# EAGLE design Bidirectional_Amp_test (EAGLE 9.5.1)
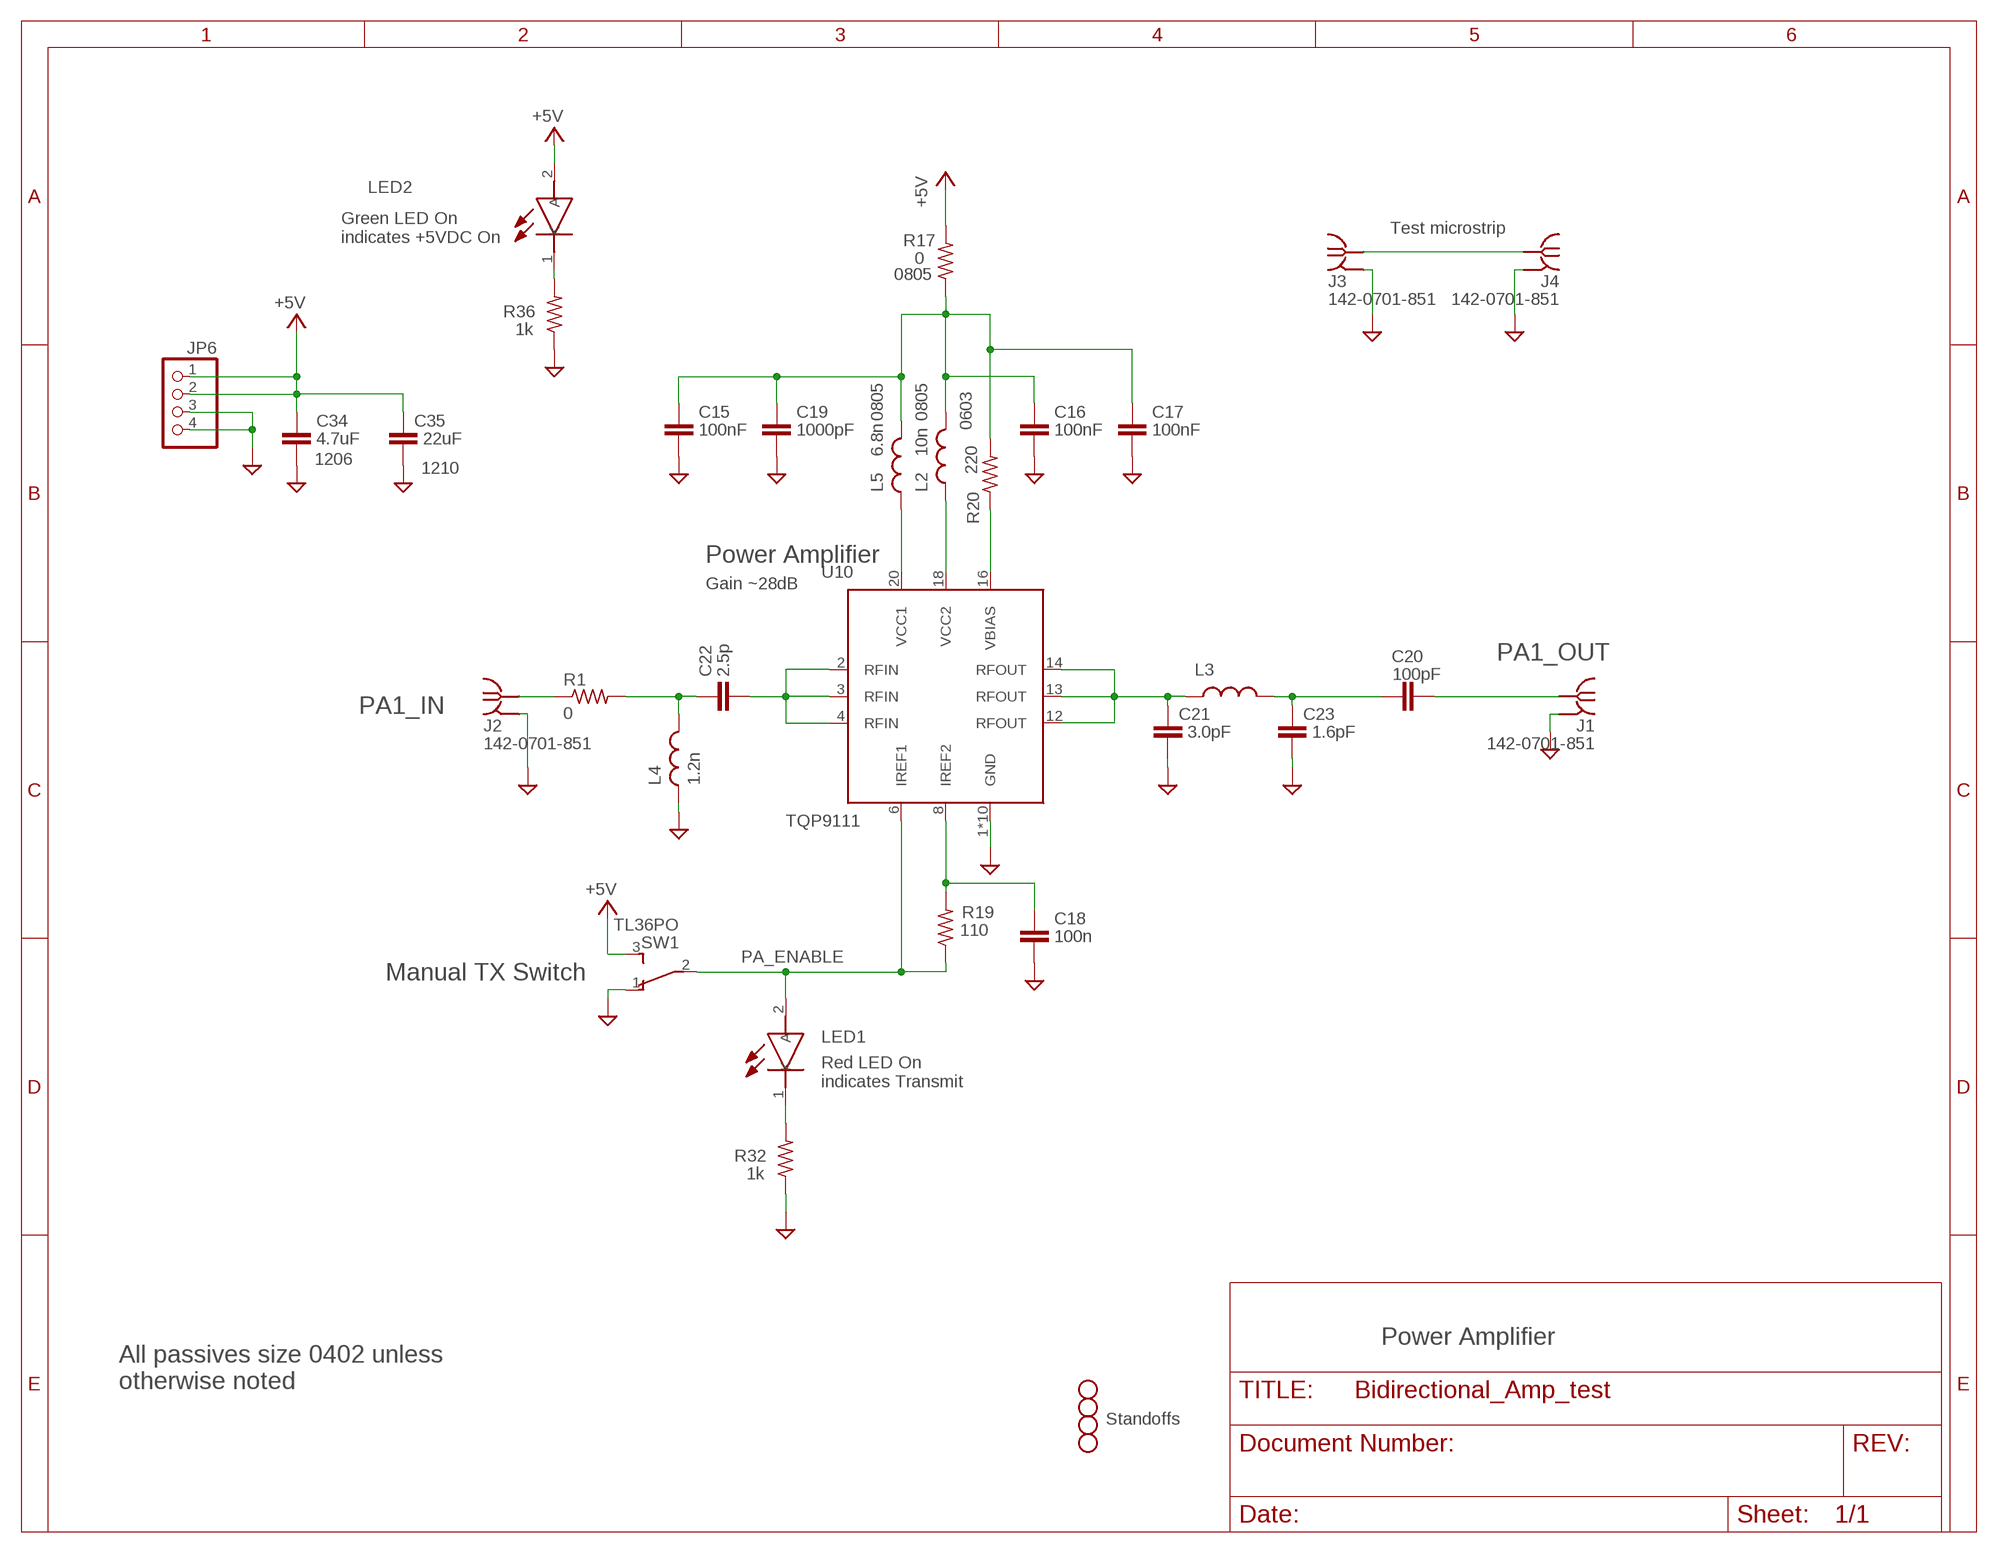
[diagram p0: schematic, sheet 1]

## Parts
C15  100nF  C-EU0402-B-NOSILK  [.0402-B-NOSILK]
C16  100nF  C-EU0402-B-NOSILK  [.0402-B-NOSILK]
C17  100nF  C-EU0402-B-NOSILK  [.0402-B-NOSILK]
C18  100n  C-EU0402-C-NOSILK  [.0402-C-NOSILK]
C19  1000pF  C-EU0402-B-NOSILK  [.0402-B-NOSILK]
C20  100pF  C-EU0402-C-NOSILK  [.0402-C-NOSILK]
C21  3.0pF  C-EU0402-C-NOSILK  [.0402-C-NOSILK]
C22  2.5p  C-EU0402-C-NOSILK  [.0402-C-NOSILK]
C23  1.6pF  C-EU0402-C-NOSILK  [.0402-C-NOSILK]
C34  4.7uF  C-EUC1206  [C1206]
C35  22uF  C-EUC1210  [C1210]
H1  STAND-OFFTIGHT  [STAND-OFF-TIGHT]
H2  STAND-OFFTIGHT  [STAND-OFF-TIGHT]
H3  STAND-OFFTIGHT  [STAND-OFF-TIGHT]
H4  STAND-OFFTIGHT  [STAND-OFF-TIGHT]
J1  142-0701-851  [142-0701-851]
J2  142-0701-851  [142-0701-851]
J3  142-0701-851  [142-0701-851]
J4  142-0701-851  [142-0701-851]
JP6  PINHD-1X4  [1X04]
L2  10n  L-US0805-C-NOSILK  [.0805-C-NOSILK]
L3  1.0nH  L-US0402-C-NOSILK  [.0402-C-NOSILK]
L4  1.2n  L-US0402-C-NOSILK  [.0402-C-NOSILK]
L5  6.8n  L-US0805-C-NOSILK  [.0805-C-NOSILK]
LED1  LTST-C193KRKT-5A  [LEDC1607X80N]
LED2  LTST-C193KGKT-5A  [LEDC1607X80N]
R1  0  R-US_0402-C-NOSILK  [.0402-C-NOSILK]
R17  0  R-US_R0805  [R0805]
R19  110  R-US_0402-B-NOSILK  [.0402-B-NOSILK]
R20  220  R-US_0603-C-NOSILK  [.0603-C-NOSILK]
R32  1k  R-US_0402-B-NOSILK  [.0402-B-NOSILK]
R36  1k  R-US_0402-B-NOSILK  [.0402-B-NOSILK]
SW1  TL36PO  [TL3XPO]
U10  TQP9111  [QFN50P400X400X102-21N]

## Nets
+5V: C34.1 C35.1 JP6.1 JP6.2 LED2.2(A) R17.2 SW1.3(S)
GND: C15.2 C16.2 C17.2 C18.2 C19.2 C21.2 C23.2 C34.2 C35.2 J1.GND1(GND) J1.GND2(GND) J1.GND3(GND) J1.GND4(GND) J2.GND1(GND) J2.GND2(GND) J2.GND3(GND) J2.GND4(GND) J3.GND1(GND) J3.GND2(GND) J3.GND3(GND) J3.GND4(GND) J4.GND1(GND) J4.GND2(GND) J4.GND3(GND) J4.GND4(GND) JP6.3 JP6.4 L4.1 R32.1 R36.1 SW1.1(O) U10.1(GND) U10.5(GND) U10.7(GND) U10.9(GND) U10.10(GND) U10.11(GND) U10.15(GND) U10.17(GND) U10.19(GND) U10.21(GND)
N$1 [RF]: J2.RF1(RF) R1.1
N$2 [RF]: J3.RF1(RF) J4.RF1(RF)
N$15: LED1.1(K) R32.2
N$16: L2.1 U10.18(VCC2)
N$21: C15.1 C16.1 C17.1 C19.1 L2.2 L5.2 R17.1 R20.2
N$22: C18.1 R19.2 U10.8(IREF2)
N$24 [RF]: C21.1 L3.1 U10.12(RFOUT) U10.13(RFOUT) U10.14(RFOUT)
N$25 [RF]: C22.1 L4.2 R1.2
N$27 [RF]: C20.1 C23.1 L3.2
N$30: R20.1 U10.16(VBIAS)
N$31: L5.1 U10.20(VCC1)
N$51: LED2.1(K) R36.2
N$56 [RF]: C22.2 U10.2(RFIN) U10.3(RFIN) U10.4(RFIN)
PA1_OUT [RF]: C20.2 J1.RF1(RF)
PA_ENABLE: LED1.2(A) R19.1 SW1.2(P) U10.6(IREF1)

## Notes on the sheet
- Test microstrip
- Green LED On
  indicates +5VDC On
- 0805
- 0805 | 0805
- 0603
- 1206
- 1210
- Power Amplifier
- Gain ~28dB
- PA1_IN
- Manual TX Switch
- Red LED On
  indicates Transmit
- Power Amplifier
- All passives size 0402 unless
  otherwise noted
- Standoffs

## Library data of the parts
C15-C18 = oresat-rcl:C-EU: CAPACITOR, European symbol; DESCRIPTION: CAP CER 0.1UF 16V X7R 0402; MFR: TDK; MPN: CGA2B1X7R1C104K050BC
C19 = oresat-rcl:C-EU: CAPACITOR, European symbol; DESCRIPTION: CAP CER 1000PF 50V NP0 0402; MFR: TDK; MPN: CGA2B2NP01H102J050BA
C20 = oresat-rcl:C-EU: CAPACITOR, European symbol; DESCRIPTION: CAP CER 100PF 50V C0G/NP0 0603; MFR: Murata; MPN: GCM1885C1H101JA16D
C21 = oresat-rcl:C-EU: CAPACITOR, European symbol; DESCRIPTION: CAP CER 3PF 50V NP0 0402; MFR: AVX; MPN: 04025U3R0BAT2A
C22 = oresat-rcl:C-EU: CAPACITOR, European symbol; DESCRIPTION: Capacitor Thin Film 50V 2.5pF .03pFTol 0402; MFR: AVX; MPN: 04025J2R5QBSTR
C23 = oresat-rcl:C-EU: CAPACITOR, European symbol; DESCRIPTION: CAP CER 1.6PF 50V NP0 0402; MFR: AVX; MPN: 04025U1R6BAT2A
C34 = rcl:C-EU: CAPACITOR, European symbol; DESCRIPTION: CAP CER 4.7UF 16V X7R 1206; MFR: Murata; MPN: GCJ31CR71C475KA01L; SPICEPREFIX: C
C35 = rcl:C-EU: CAPACITOR, European symbol; DESCRIPTION: CAP CER 22UF 16V X7R 1210; MFR: Murata; MPN: GCJ32ER71C226KE01L; SPICEPREFIX: C
H1-H4 = SparkFun-Hardware:STAND-OFF: Stand Off Drill holes for mechanically mounting via screws, standoffs, etc. Note: Use the keepout ring to avoid running the screw head into surrounding components. Variant Overviews STAND-OFF - Mechanical footprint for a #4 phillips button head screw. STAND-OFF-TIGHT - Mechanical footprint for a #4 phillips button head screw, Example SparkFun Products Screw - Phillips Head (1/4", 4-40, 10 pack) <https://www.sparkfun.com/products/10453> (PRT-10453) Screw - Phillips Head (1/2", 4-40, 10 pack) <https://www.sparkfun.com/products/10452> (PRT-10452) Screw - Phillips Head (3/4", 4-40, 10 pack) <https://www.sparkfun.com/products/10451> (PRT-10451) Screw - Phillips Head (1", 4-40, 10 pack) <https://www.sparkfun.com/products/10450> (PRT-10450)
J1-J4 = J-Cinch-142-0701-851-SMA-end-launch:142-0701-851: SMA Jack 50Ω - End Launch Source: Datasheet <https://belfuse.com/resources/productinformations/cinchconnectivitysolutions/johnson/pi-ccs-john-142-0701-851.pdf>; DESCRIPTION: CONN SMA JACK STR 50OHM EDGE MNT; MFR: Cinch Connectivity Solutions Johnson; MPN: 142-0701-851
JP6 = pinhead:PINHD-1X4: PIN HEADER; DESCRIPTION: CONN HEADER VERT 4POS 2.54MM; MFR: Molex; MPN: 0022232041
L2 = oresat-rcl:L-US: INDUCTOR, American symbol; DESCRIPTION: Fixed Inductors 080xSQ AirCore RF 10.2 nH 2 % 2.7 A; MFR: Coilcraft; MPN: 0807SQ-10NGLB
L3 = oresat-rcl:L-US: INDUCTOR, American symbol; DESCRIPTION: FIXED IND 1NH 500MA 100 MOHM SMD; MFR: TDK Corporation; MPN: MLK1005S1N0ST000
L4 = oresat-rcl:L-US: INDUCTOR, American symbol; DESCRIPTION: 1.2nH RF Inductor, ceramic core, 5% tol, SMT, RoHS, halogen-free; MFR: Coilcraft; MPN: 0402CT-1N2XJRW
L5 = oresat-rcl:L-US: INDUCTOR, American symbol; DESCRIPTION: Fixed Inductors 0805CS 6.8 nH 5 % 0.6 A; MFR: Coilcraft; MPN: 0805CS-060XJLC
LED1 = SamacSys_Parts:LTST-C193KRKT-5A: LED,SMD,0603,Red, Lite-On LTST-C193KRKT-5A Red LED, 631 nm, 1608 (0603), Rectangle Lens SMD Package Source: Datasheet <http://docs-europe.electrocomponents.com/webdocs/0dc0/0900766b80dc02a7.pdf>; DESCRIPTION: LED,SMD,0603,Red,Lite-On 1608 (0603), Rectangle Lens SMD Package; MFR: Lite-On; MPN: LTST-C193KRKT-5A
LED2 = SamacSys_Parts:LTST-C193KGKT-5A: LED,SMD,0603,Green, Lite-On LTST-C193KGKT-5A 1608 (0603), Rectangle Lens SMD Package Source: Datasheet <http://docs-europe.electrocomponents.com/webdocs/0dc0/0900766b80dc02a7.pdf>; DESCRIPTION: LED,SMD,0603,Green,Lite-On 1608 (0603), Rectangle Lens SMD Package; MFR: Lite-On; MPN: LTST-C193KGKT-5A
R1 = oresat-rcl:R-US_: RESISTOR, American symbol; DESCRIPTION: RES SMD 0 OHM JUMPER 1/10W 0402; MFR: Panasonic Electronic Components; MPN: ERJ-2GE0R00X
R17 = rcl:R-US_: RESISTOR, American symbol; DESCRIPTION: RES SMD 0 OHM JUMPER 1/8W 0805; MFR: Panasonic; MPN: ERJ-6GEY0R00V; SPICEPREFIX: R
R19 = oresat-rcl:R-US_: RESISTOR, American symbol; DESCRIPTION: RES SMD 110 OHM 1% 1/10W 0402; MFR: Panasonic; MPN: ERJ-2RKF1100X
R20 = oresat-rcl:R-US_: RESISTOR, American symbol; DESCRIPTION: RES SMD 220 OHM 1% 1/10W 0603; MFR: Panasonic; MPN: ERJ-3EKF2200V
R32 R36 = oresat-rcl:R-US_: RESISTOR, American symbol; DESCRIPTION: RES SMD 1K OHM 5% 1/10W 0402; MFR: Panasonic; MPN: ERJ-2GEJ102X
SW1 = switch:TL36PO: TINY SWITCH ON - ON Source: http://www2.produktinfo.conrad.com/datenblaetter/700000-724999/705152-da-01-de-Subminiaturschalter_TL_36YO.pdf; DESCRIPTION: SWITCH TOGGLE SPDT 0.4VA 20V; MFR: APEM Inc.; MPN: TL36P005000
U10 = oresat-samacsys_Parts:TQP9111: RF Amplifier 1.8-2.7GHz Gn 29.8dB P1dB 32.5dBm 2 stage Source: Datasheet <https://componentsearchengine.com/Datasheets/1/TQP9111.pdf>; DESCRIPTION: RF Amplifier 1.8-2.7GHz Gn 29.8dB P1dB 32.5dBm 2 stage; HEIGHT: 1.02mm; MFR: Qorvo; MPN: TQP9111

## Net classes
1 RF: clearance 0.8 mm

## Board
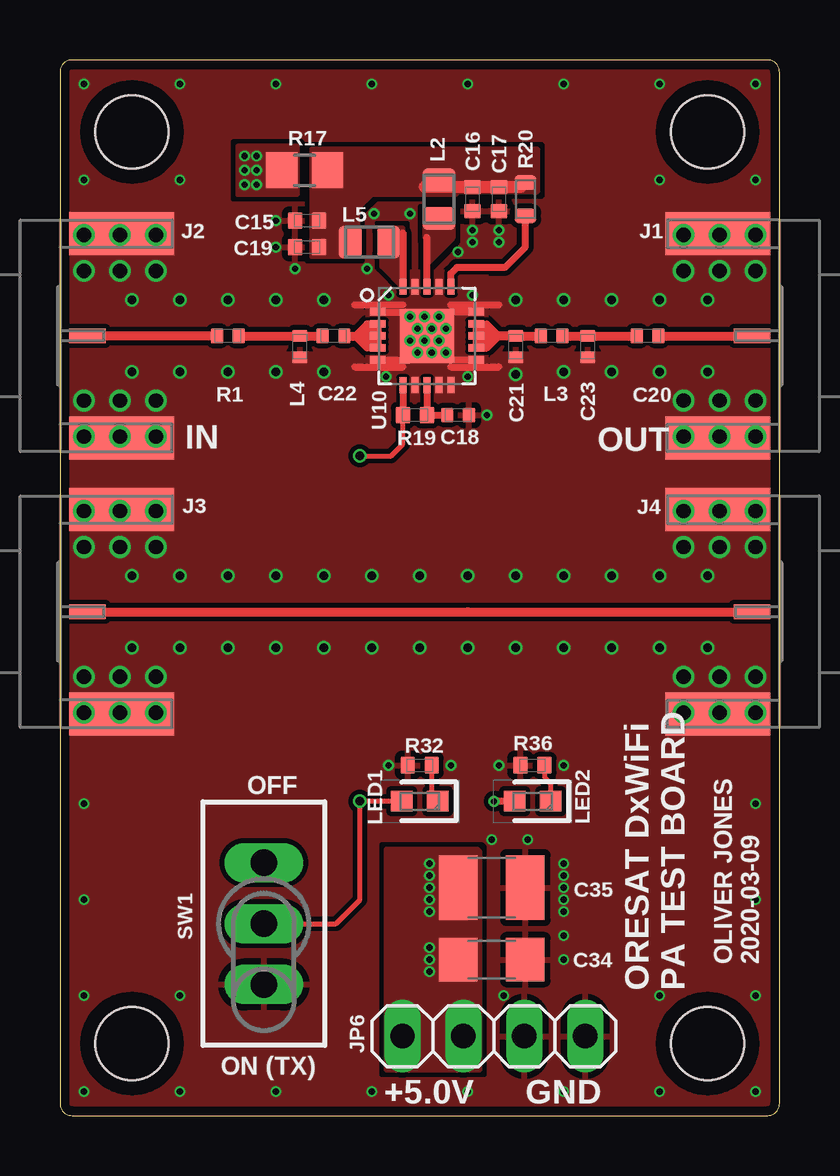
[diagram p1: board, top side]
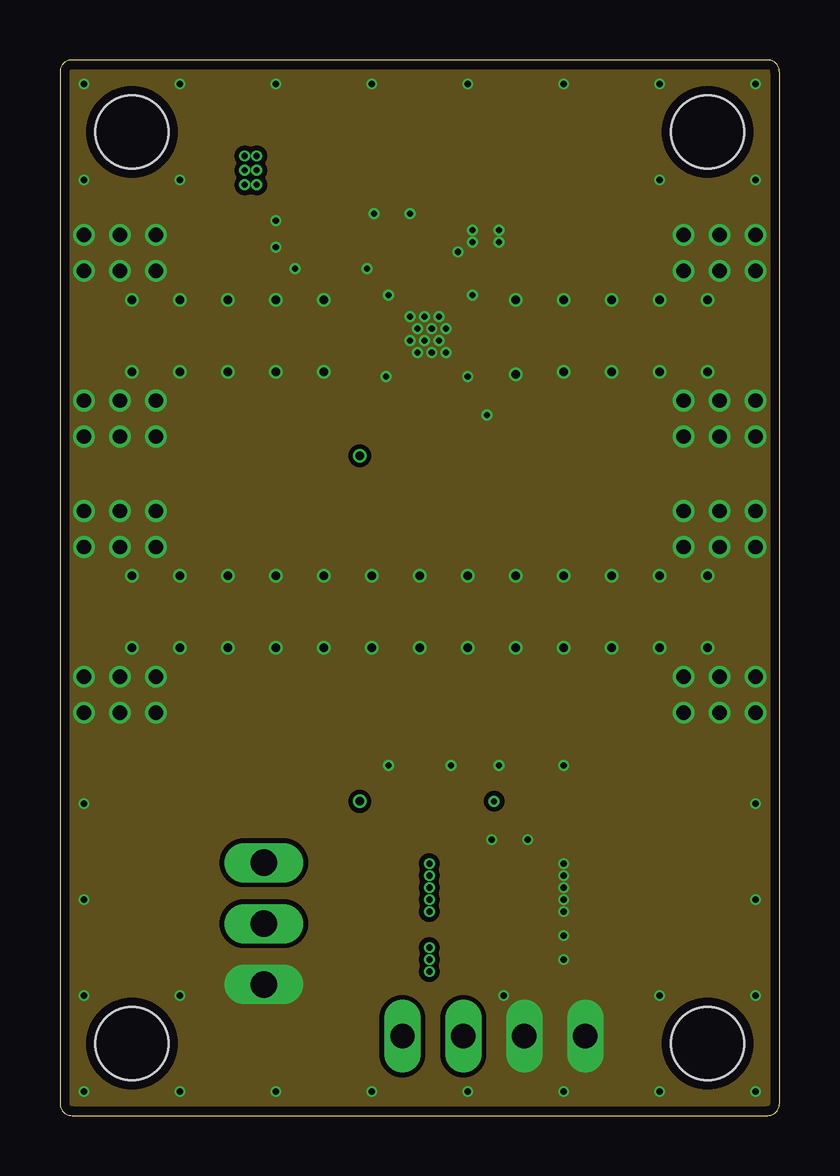
[diagram p2: board, inner layer Route2]
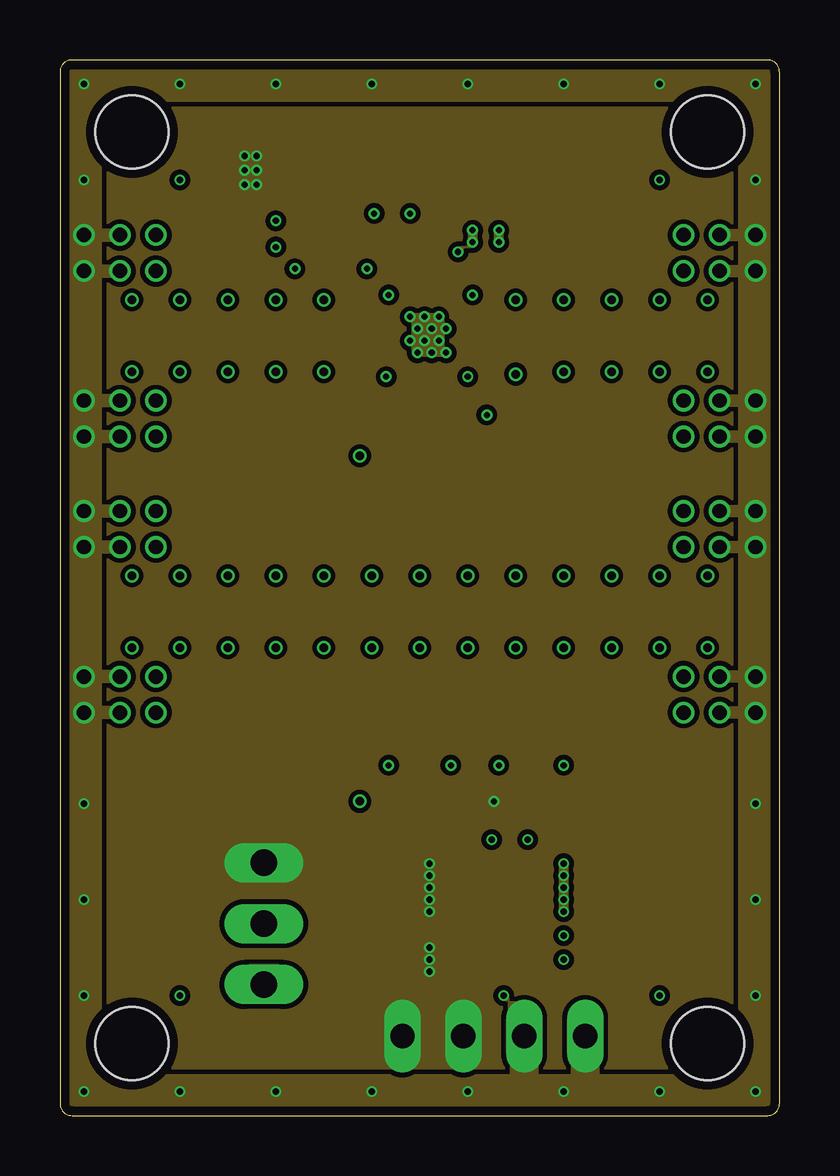
[diagram p3: board, inner layer Route15]
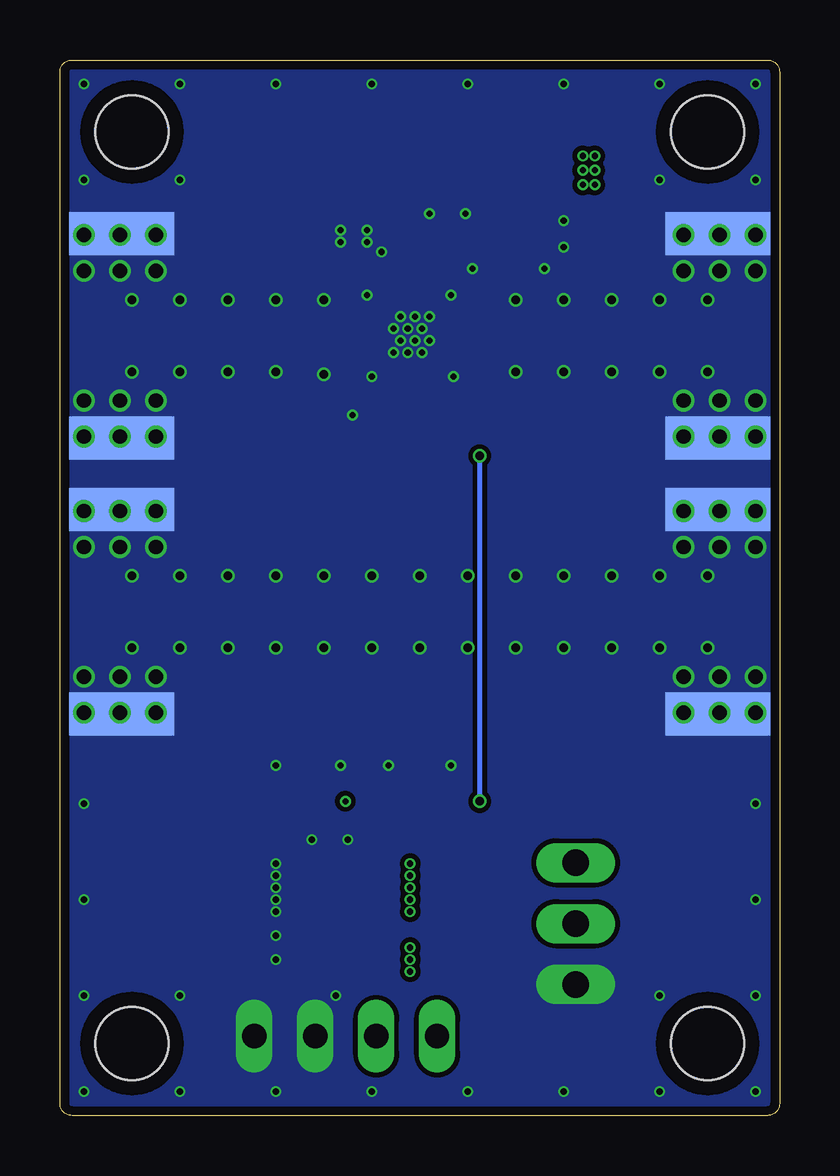
[diagram p4: board, bottom side, seen from below]

Size 30 x 44 mm. Coordinates in mm from the lower left corner, seen from the top.
Outline: 0,43.5 0,0.5 arc90 0.5,0 29.5,0 arc90 30,0.5 30,43.5 arc90 29.5,44 0.5,44 arc90 0,43.5
Copper layers (1*2*15*16): Top 0.035559375mm / dielectric 0.17018125mm / Route2 0.01778125mm / dielectric 47mil / Route15 0.01778125mm / dielectric 0.17018125mm / Bottom 0.035559375mm
Design rules "oshpark-4layer-tented": minimum track width 5mil, minimum drill 10mil, track to track 5mil, track to pad 5mil, pad to pad 5mil, via to via 5mil, smd to smd 5mil, copper to edge 15mil, drill to drill 6mil, minimum pad ring 4mil, minimum via ring 4mil, stop-mask expansion 2.5mil, vias tented up to drill 20mil, thermal gap 10mil
tRestrict: 1 lines

### Footprints (pad centres in the part's own frame; a part is rotated, then mirrored left to right if it is on the bottom)
.0402-B-NOSILK = smd 0.6 x 0.7: 1 -0.5,0; 2 0.5,0
.0402-C-NOSILK = smd 0.5 x 0.6: 1 -0.45,0; 2 0.45,0
C1206 = smd 1.6 x 1.8: 1 -1.4,0; 2 1.4,0
C1210 = smd 1.6 x 2.7: 1 -1.4,0; 2 1.4,0
STAND-OFF-TIGHT = hole 3.048: 0,0
142-0701-851 = smd 1.8 x 4.37: GND1 -4.255,-2.566; GND2 4.255,-2.566 | smd 1.8 x 4.37 bottom: GND3 -4.255,-2.566; GND4 4.255,-2.566 | smd 0.6 x 1.53: RF1 0,-1.146
1X04 = drill 1.016 long: 1 -3.81,0; 2 -1.27,0; 3 1.27,0; 4 3.81,0
.0805-C-NOSILK = smd 0.95 x 1.35: 1 -0.8,0; 2 0.8,0
LEDC1607X80N = smd 0.9 x 0.85: 1 -0.75,0; 2 0.75,0
R0805 = smd 1.3 x 1.5: 1 -0.95,0; 2 0.95,0
.0603-C-NOSILK = smd 0.6 x 0.9: 1 -0.7,0; 2 0.7,0
TL3XPO = drill 1.1 pad 1.422 long: 1 -2.54,0; 2 0,0; 3 2.54,0
QFN50P400X400X102-21N = smd 0.65 x 0.3: 1 -2.05,1; 2 -2.05,0.5; 3 -2.05,0; 4 -2.05,-0.5; 5 -2.05,-1; 11 2.05,-1; 12 2.05,-0.5; 13 2.05,0; 14 2.05,0.5; 15 2.05,1 | smd 0.3 x 0.65: 6 -1,-2.05; 7 -0.5,-2.05; 8 0,-2.05; 9 0.5,-2.05; 10 1,-2.05; 16 1,2.05; 17 0.5,2.05; 18 0,2.05; 19 -0.5,2.05; 20 -1,2.05 | smd 2.25 x 2.25: 21 0,0

### Placement (x,y rotation side)
C15  10.3,37.3 180 top
C16  17.2,38.2 270 top
C17  18.3,38.2 270 top
C18  16.6,29.2 0 top
C19  10.3,36.2 180 top
C20  24.5,32.5 0 top
C21  19,32.05 270 top
C22  11.4,32.5 0 top
C23  22,32.05 270 top
C34  18,6.5 0 top
C35  18,9.5 0 top
H1  27,41 90 top
H2  27,3 90 top
H3  3,3 90 top
H4  3,41 90 top
J1  30,32.5 270 top
J2  0,32.5 90 top
J3  0,21 90 top
J4  30,21 270 top
JP6  18.09,3.31 0 top
L2  15.8,38.2 90 top
L3  20.5,32.5 0 top
L4  10,32.05 90 top
L5  12.9,36.4 180 top
LED1  15,13.1 180 top
LED2  19.7,13.1 180 top
R1  7,32.5 0 top
R17  10.2,39.4 180 top
R19  14.8,29.2 0 top
R20  19.4,38.2 90 top
R32  15,14.6 0 top
R36  19.7,14.6 0 top
SW1  8.5,8 90 top
U10  15.3,32.5 0 top

### Tracks (layer width: path | path; a pad name or v marks a point on that pad's centre or on a via)
+5V  (via drill 0.25)
  Top 0.3: LED2.2 v18.1,13.1
  other vias: 8.2,40 15.4,6 15.4,6.5 15.4,7 15.4,8.5 15.4,9 15.4,9.5 15.4,10 15.4,10.5 8.2,39.4 8.2,38.8 7.7,39.4 7.7,40 7.7,38.8
  pour Route15 (isolate 0.2, rank 2, no thermals): 28,42 28,2 2,2 2,42
  pour Top (no thermals): 17.5,1.9 17.5,11 17.4,11.1 13.6,11.1 13.6,1.9
  pour Top (no thermals): 9.9,38.4 9.9,40.4 7.4,40.4 7.4,38.4
GND  (via drill 0.25, 0.25 pad 0, 0.35, 0.6)
  Top 0.3: U10.5 14.6,31.5 v14.9,31.8 | U10.11 16.4,31.5 v16.1,31.8 | U10.15 16,33.5 v15.8,33.3 | U10.1 14.4,33.5 v14.6,33.3 | 12.3,33.8 14.3,33.8 | 16.3,33.8 18.3,33.8 | 16.3,31.2 18.3,31.2 | 12.3,31.2 14.3,31.2
  other vias: 21,10.5 18.3,14.6 13.7,14.6 16.3,14.6 1,1 1,43 5,43 9,43 13,43 17,43 21,43 1,39 5,39 3,34 5,34 1,5 5,5 5,1 25,1 21,1 17,1 13,1 9,1 1,9 1,13 13.6,30.8 17,30.8 13.7,34.2 17.2,34.2 15.5,32.8 15.2,33.3 14.9,32.8 16.1,32.8 15.5,31.8 21,10 21,9.5 19.5,11.5 21,6.5 21,7.5 21,8.5 21,9 18,11.5 18.5,5 18.3,36.9 17.2,36.9 9,36.2 9,37.3 9.8,35.3 14.6,32.3 15.2,32.3 15.8,32.3 29,36.7 27.5,36.7 26,36.7 26,28.3 27.5,28.3 29,28.3 1,36.7 2.5,36.7 4,36.7 4,28.3 2.5,28.3 1,28.3 1,29.8 2.5,29.8 4,29.8 4,35.2 1,35.2 2.5,35.2 26,35.2 27.5,35.2 29,35.2 29,29.8 27.5,29.8 26,29.8 3,31 5,31 7,34 7,31 29,43 29,39 25,39 25,43 9,34 11,34 9,31 11,31 27,31 27,34 25,34 23,34 21,34 19,34 25,31 23,31 21,31 19,30.9 17.2,36.4 18.3,36.4 16.6,36 14.6,37.6 13.1,37.6 12.8,35.3 17.8,29.2 3,22.5 3,19.5 5,19.5 7,19.5 9,19.5 11,19.5 13,19.5 15,19.5 17,19.5 19,19.5 21,19.5 23,19.5 25,19.5 27,19.5 5,22.5 7,22.5 9,22.5 11,22.5 13,22.5 15,22.5 17,22.5 19,22.5 21,22.5 23,22.5 25,22.5 27,22.5 4,16.8 2.5,16.8 1,16.8 1,18.3 2.5,18.3 4,18.3 4,25.2 2.5,25.2 1,25.2 1,23.7 2.5,23.7 4,23.7 29,25.2 27.5,25.2 26,25.2 26,23.7 27.5,23.7 29,23.7 29,16.8 27.5,16.8 26,16.8 26,18.3 27.5,18.3 29,18.3 21,14.6 29,1 29,5 25,5 29,9 29,13
  pour Route2 (isolate 0.2, no thermals): 0,44 30,44 30,0 0,0
  pour Bottom (isolate 0.2, rank 2, no thermals): 0,44 30,44 30,0 0,0
  pour Top (isolate 0.2, rank 5): 0,0 0,44 30,44 30,0
  pour Top (rank 3, no thermals): 12.8,35.2 17.8,35.2 17.8,29.8 12.8,29.8
  pour Route15 (isolate 0.2, rank 6, no thermals): 30,44 30,0 0,0 0,44
  pour Top (no thermals): 0,38.3 5.3,38.3 5.3,35 0,35
  pour Top (no thermals): 0,30 5.3,30 5.3,26.7 0,26.7
  pour Top (no thermals): 24.7,38.3 30,38.3 30,35 24.7,35
  pour Top (no thermals): 24.7,29.8 30,29.8 30,26.5 24.7,26.5
  pour Top (no thermals): 9.3,31.8 10.7,31.8 10.7,31 9.3,31
  pour Top (no thermals): 18.3,31.8 19.7,31.8 19.7,31 18.3,31
  pour Top (no thermals): 21.3,31.8 22.7,31.8 22.7,31 21.3,31
  pour Top (no thermals): 0,27 5.3,27 5.3,23.7 0,23.7
  pour Top (no thermals): 0,18.4 5.3,18.4 5.3,15.1 0,15.1
  pour Top (no thermals): 24.7,18.3 30,18.3 30,15 24.7,15
  pour Top (no thermals): 24.7,26.8 30,26.8 30,23.5 24.7,23.5
N$1
  Top 0.38: R1.1 J2.RF1
N$2
  Top 0.38: J3.RF1 17,21 J4.RF1
N$15
  Top 0.2: LED1.1 15.5,13.35 R32.2
N$16
  Top 0.3: U10.18 15.3,36.6
  pour Top (no thermals): 15.3,35.5 16.4,36.6 16.4,37.7 15.2,37.7 15.2,36.6 15.3,36.5
N$21
  Top 0.5: R20.2 19.2,38.7 C17.1 C16.1 15.21,38.7
  pour Top (no thermals): 19.9,40.3 19.9,38.5 16.6,38.5 16.49,38.39 13,38.39 12.4,37.8 12.4,35.8 10.5,35.8 10.5,40.3
N$22
  Top 0.3: U10.8 R19.2 C18.1
N$24
  Top 0.127: U10.13 17.55,32.7 17.65,32.7
  Top 0.3: U10.14 U10.13 U10.12 17.8,32 18.3,32.5 17.8,33 U10.14
  Top 0.38: U10.13 C21.1 L3.1
  Top 0.5: 17.65,32.7 17.65,32.2
N$25
  Top 0.38: R1.2 L4.2 C22.1
N$27
  Top 0.38: L3.2 C23.1 C20.1
N$30
  Top 0.3: U10.16 16.3,35.1 16.55,35.35 18.55,35.35 19.4,36.2 R20.1
N$31
  Top 0.3: 14.3,36.8 U10.20
  pour Top (no thermals): 14.3,34.5 14.3,37 13.4,37 13.4,35.4
N$51
  Top 0.2: R36.2 20.2,14.1 20.45,13.85 LED2.1
N$56
  Top 0.127: U10.4 13.15,32 13,32.15 | 13,32.8 12.8,32.8
  Top 0.3: U10.3 12.3,32.5 | 12.3,32.5 C22.2 | U10.3 U10.2 12.8,33 12.3,32.5 | U10.3 U10.4 12.8,32 12.3,32.5 | 13,32.15 13,32.8 | 12.8,32.8 12.8,32.15
  Top 0.38: C22.2 U10.3
PA1_OUT
  Top 0.38: C20.2 J1.RF1
PA_ENABLE  (via drill 0.35)
  Top 0.2: R19.1 14.3,28 13.8,27.5 v12.5,27.5 | SW1.2 11.5,8 12.5,9 v12.5,13.1 LED1.2
  Top 0.3: U10.6 R19.1
  Bottom 0.2: v12.5,13.1 12.5,19.29 12.5,22.71 v12.5,27.5

### Text on the board
tPlace: IN | OUT | OFF | OLIVER JONES / 2020-03-09 | ORESAT DxWiFi / PA TEST BOARD | ON (TX) | +5.0V | GND